# Altium schematic sheet touch.SchDoc
size A4
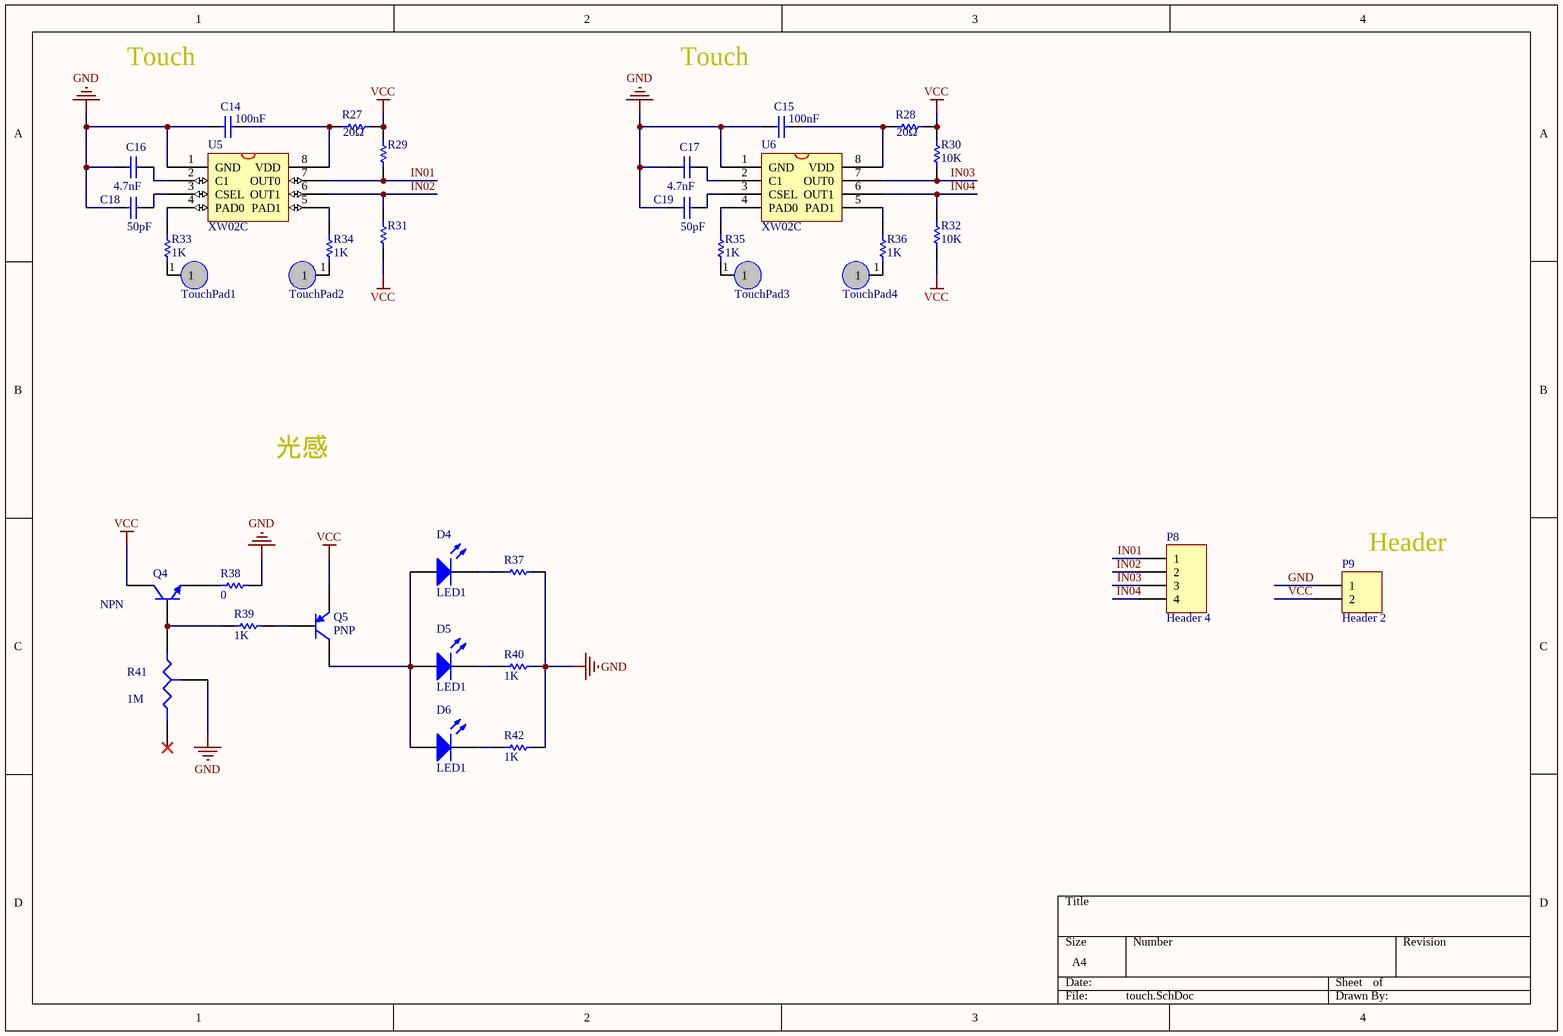
[diagram p0: touch.SchDoc]

## Parts
C14  100nF  [0603p]
C15  100nF  [0603p]
C16  4.7nf  [0603p]
C17  4.7nf  [0603p]
C18  50pf  [0603p]
C19  50pf  [0603p]
D4  LED1  [0805]
D5  LED1  [0805]
D6  LED1  [0805]
P8  Header 4  [HDR1X4]
P9  Header 2  [HDR1X2]
Q4  NPN  [TEMT6000X01]
Q5  PNP  [SOT-23R]
R27  20Ω  [0603p]
R28  20Ω  [0603p]
R29  10K  [0603p]  (value not drawn)
R30  10K  [0603p]
R31  10K  [0603p]  (value not drawn)
R32  10K  [0603p]
R33  1K  [0603p]
R34  1K  [0603p]
R35  1K  [0603p]
R36  1K  [0603p]
R37  1K  [0603p]  (value not drawn)
R38  0  [0603p]
R39  1K  [0603p]
R40  1K  [0603p]
R41  1M  [RM063]
R42  1K  [0603p]
TouchPad1  TouchPad  [TOUCHKEY - latch]  (value not drawn)
TouchPad2  TouchPad  [TOUCHKEY - latch]  (value not drawn)
TouchPad3  TouchPad  [TOUCHKEY - latch]  (value not drawn)
TouchPad4  TouchPad  [TOUCHKEY - latch]  (value not drawn)
U5  XW02C  [SOP-8L]
U6  XW02C  [SOP-8L]

## Nets
GND: C14.1 C15.1 C16.1 C17.1 C18.1 C19.1 P9.1 R37.1 R38.1 R40.1 R41.2(TAP) R42.1 U5.1(GND) U6.1(GND)
VCC: P9.2 Q4.1(C) Q5.3(E) R27.2 R28.2 R29.2 R30.2 R31.1 R32.1
IN01: P8.1 R29.1 U5.7(OUT0)
IN02: P8.2 R31.2 U5.6(OUT1)
IN03: P8.3 R30.1 U6.7(OUT0)
IN04: P8.4 R32.2 U6.6(OUT1)
NetC14_2: C14.2 R27.1 U5.8(VDD)
NetC15_2: C15.2 R28.1 U6.8(VDD)
NetC16_2: C16.2 U5.2(C1)
NetC17_2: C17.2 U6.2(C1)
NetC18_2: C18.2 U5.3(CSEL)
NetC19_2: C19.2 U6.3(CSEL)
NetD4_1: D4.1(A) D5.1(A) D6.1(A) Q5.1(C)
NetD4_2: D4.2(K) R37.2
NetD5_2: D5.2(K) R40.2
NetD6_2: D6.2(K) R42.2
NetQ4_2: Q4.2(B) R39.2 R41.1(A)
NetQ4_3: Q4.3(E) R38.2
NetQ5_2: Q5.2(B) R39.1
NetR33_1: R33.1 TouchPad1.1
NetR33_2: R33.2 U5.4(PAD0)
NetR34_1: R34.1 TouchPad2.1
NetR34_2: R34.2 U5.5(PAD1)
NetR35_1: R35.1 TouchPad3.1
NetR35_2: R35.2 U6.4(PAD0)
NetR36_1: R36.1 TouchPad4.1
NetR36_2: R36.2 U6.5(PAD1)

Not connected (* = marked no-connect by the designer): R41 3(B)*

## Notes on the sheet
- Touch
- 光感
- (near P9) Header

## Library data of the parts
C14-C19 = Cap: Capacitor; Published: 8-Jun-2000; LatestRevisionDate: 17-Jul-2002; LatestRevisionNote: Re-released for DXP Platform.; PackageReference: RAD-0.3; Publisher: Altium Limited; PackageDescription: Radial Cap, Thru-Hole; 2 Leads; 0.3 in Pin Spacing
  C14 C15: Value: 100nF
  C16 C17: Value: 4.7nF
  C18 C19: Value: 50pF
D4-D6 = LED1: Typical RED GaAs LED; Published: 8-Jun-2000; LatestRevisionDate: 08-Jul-2005; LatestRevisionNote: Mech Layer 1 removed.; PackageReference: LED-1; Publisher: Altium Limited; PackageDescription: LED; 2 Leads
P8 = Header 4: Header, 4-Pin; LatestRevisionDate: 17-Jul-2002; LatestRevisionNote: Re-released for DXP Platform.; Publisher: Altium Limited
P9 = Header 2: Header, 2-Pin; LatestRevisionDate: 17-Jul-2002; LatestRevisionNote: Re-released for DXP Platform.; Publisher: Altium Limited
Q4 = NPN: NPN Bipolar Transistor; Published: 8-Jun-2000; LatestRevisionDate: 17-Jul-2002; LatestRevisionNote: Re-released for DXP Platform.; PackageReference: TO-226-AA; Publisher: Altium Limited; PackageDescription: TO, Flat Index; 3 In-Line, Axial Leads; Body Dia. 4.8mm; Leads 0.55 x 0.51 mm (max); Code_JEDEC: TO-226-AA
Q5 = PNP: 8550; Published: 8-Jun-2000; LatestRevisionDate: 29-May-2009; LatestRevisionNote: IPC-7351 Footprint Added.; PackageVersion: Aug-1999; PackageReference: SOT-23B; Publisher: Altium Limited; PackageDescription: 3-Pin SOT-23 Package 0.95 mm Pitch, 2.4 mm Lead Span
R27-R40 R42 = Res1: Resistor
  R27 R28: Published: 8-Jun-2000; LatestRevisionDate: 17-Jul-2002; LatestRevisionNote: Re-released for DXP Platform.; PackageReference: AXIAL-0.3; Publisher: Altium Limited; PackageDescription: Axial Device, Thru-Hole; 2 Leads; 0.3 in Pin Spacing; Value: 20Ω
  R29-R32: Published: 8-Jun-2000; LatestRevisionDate: 17-Jul-2002; LatestRevisionNote: Re-released for DXP Platform.; PackageReference: AXIAL-0.3; Publisher: Altium Limited; PackageDescription: Axial Device, Thru-Hole; 2 Leads; 0.3 in Pin Spacing; Value: 10K
  R33-R37 R40 R42: Published: 8-Jun-2000; LatestRevisionDate: 17-Jul-2002; LatestRevisionNote: Re-released for DXP Platform.; PackageReference: AXIAL-0.3; Publisher: Altium Limited; PackageDescription: Axial Device, Thru-Hole; 2 Leads; 0.3 in Pin Spacing; Value: 1K
  R38: Published: 8-Jun-2000; LatestRevisionDate: 17-Jul-2002; LatestRevisionNote: Re-released for DXP Platform.; PackageReference: AXIAL-0.3; Publisher: Altium Limited; PackageDescription: Axial Device, Thru-Hole; 2 Leads; 0.3 in Pin Spacing; Value: 0
R41 = Res Tap: Tapped Resistor
U5 U6 = 24C256